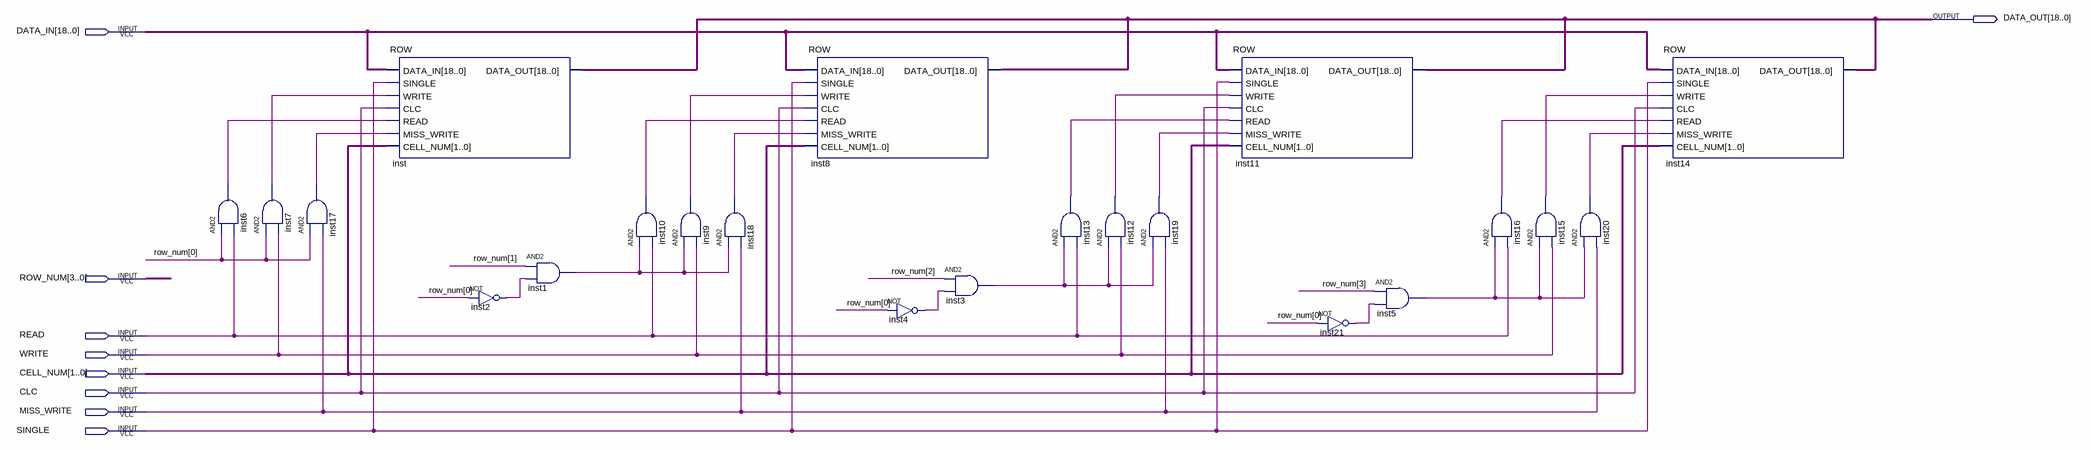
[diagram p0: schematic sheet]
// Quartus schematic DATA_MEM.bdf as structural Verilog: 22 symbols, 9 pins
module DATA_MEM (
  input  [18:0] DATA_IN,
  input  [3:0] ROW_NUM,
  input  READ,
  input  WRITE,
  input  [1:0] CELL_NUM,
  input  CLC,
  input  MISS_WRITE,
  input  SINGLE,
  output [18:0] DATA_OUT
);

  wire inst1_out, inst2_out, inst3_out, inst4_out, inst5_out, inst6_out, inst7_out, inst9_out, inst10_out,
       inst12_out, inst13_out, inst15_out, inst16_out, inst17_out, inst18_out, inst19_out, inst20_out,
       inst21_out;

  and inst6 (inst6_out, ROW_NUM[0], READ);
  and inst7 (inst7_out, ROW_NUM[0], WRITE);
  and inst17 (inst17_out, ROW_NUM[0], MISS_WRITE);
  ROW inst (
    .DATA_IN(DATA_IN), .SINGLE(SINGLE), .WRITE(inst7_out), .CLC(CLC), .READ(inst6_out),
    .MISS_WRITE(inst17_out), .CELL_NUM(CELL_NUM), .DATA_OUT(DATA_OUT));
  not inst2 (inst2_out, ROW_NUM[0]);
  and inst1 (inst1_out, ROW_NUM[1], inst2_out);
  and inst9 (inst9_out, inst1_out, WRITE);
  and inst10 (inst10_out, inst1_out, READ);
  and inst18 (inst18_out, inst1_out, MISS_WRITE);
  ROW inst8 (
    .DATA_IN(DATA_IN), .SINGLE(SINGLE), .WRITE(inst9_out), .CLC(CLC), .READ(inst10_out),
    .MISS_WRITE(inst18_out), .CELL_NUM(CELL_NUM), .DATA_OUT(DATA_OUT));
  not inst4 (inst4_out, ROW_NUM[0]);
  and inst3 (inst3_out, ROW_NUM[2], inst4_out);
  and inst13 (inst13_out, inst3_out, READ);
  and inst12 (inst12_out, inst3_out, WRITE);
  and inst19 (inst19_out, inst3_out, MISS_WRITE);
  ROW inst11 (
    .DATA_IN(DATA_IN), .SINGLE(SINGLE), .WRITE(inst12_out), .CLC(CLC), .READ(inst13_out),
    .MISS_WRITE(inst19_out), .CELL_NUM(CELL_NUM), .DATA_OUT(DATA_OUT));
  not inst21 (inst21_out, ROW_NUM[0]);
  and inst5 (inst5_out, ROW_NUM[3], inst21_out);
  and inst16 (inst16_out, inst5_out, READ);
  and inst15 (inst15_out, inst5_out, WRITE);
  and inst20 (inst20_out, inst5_out, MISS_WRITE);
  ROW inst14 (
    .DATA_IN(DATA_IN), .SINGLE(SINGLE), .WRITE(inst15_out), .CLC(CLC), .READ(inst16_out),
    .MISS_WRITE(inst20_out), .CELL_NUM(CELL_NUM), .DATA_OUT(DATA_OUT));
endmodule
